# Altium schematic sheet Power.SchDoc: Power
size A4; Author: SchumyHao; DocumentNumber: 4; Revision: V01; SheetNumber: 4; SheetTotal: 7
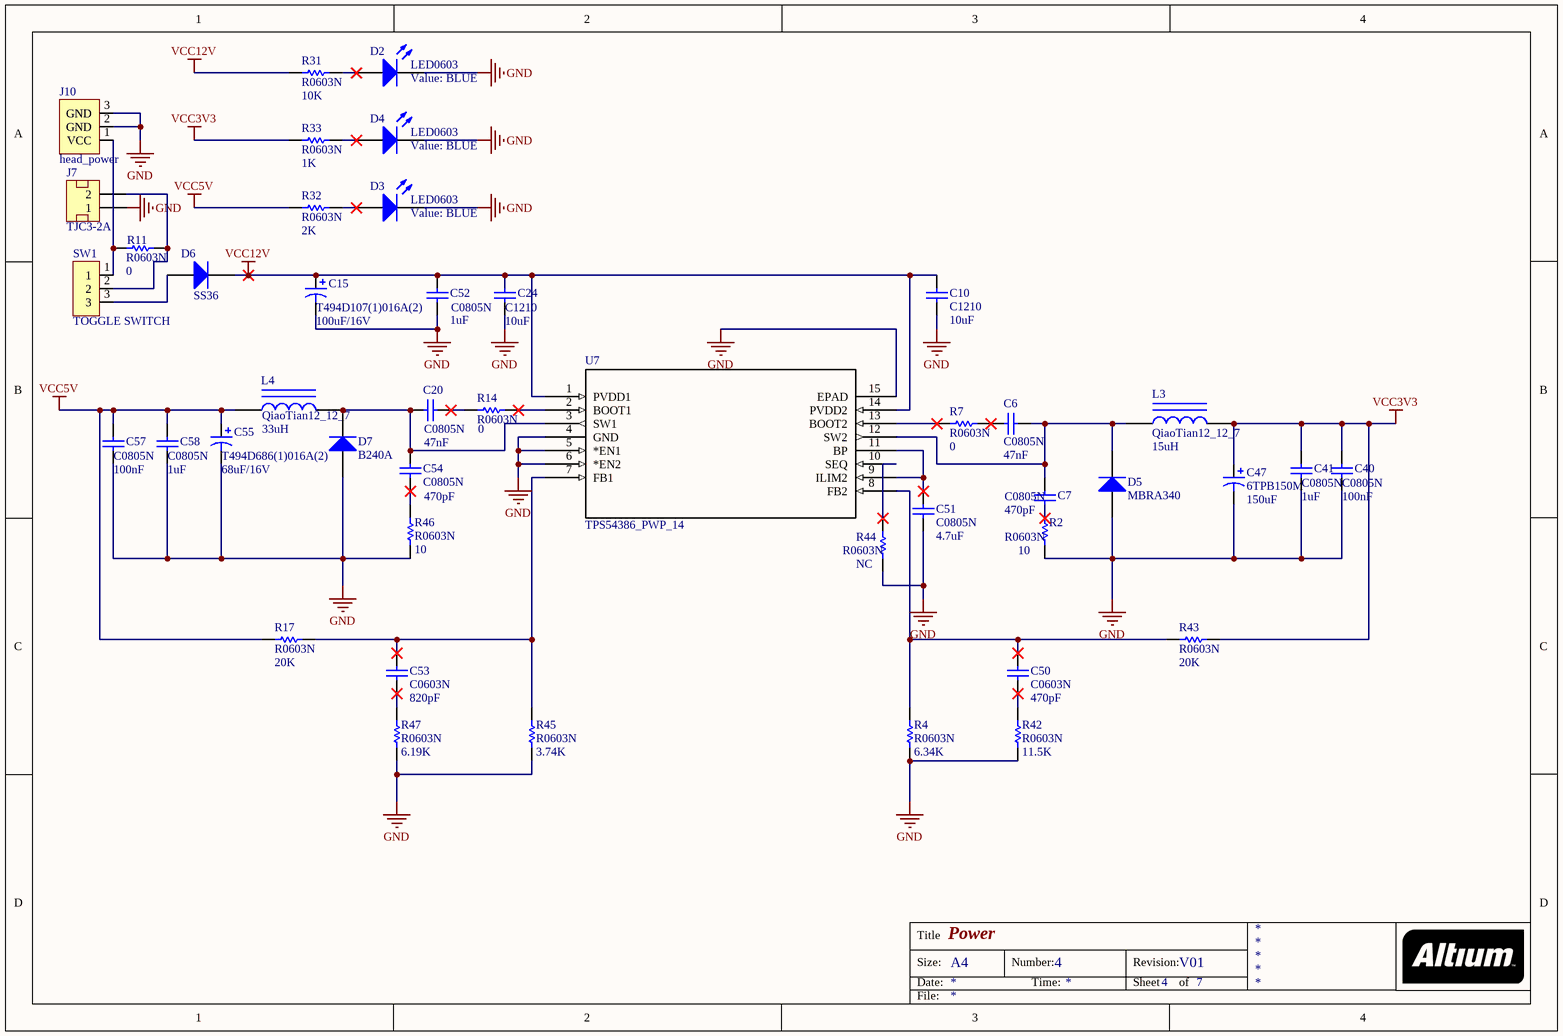
[diagram p0: Power.SchDoc]

## Parts
C6  C0805N  value 47nF  [C0805N]
C7  C0805N  value 470pF  [C0805N]
C10  C1210  value 10uF  [C1210]
C15  T494D107(1)016A(2)  value 100uF/16V  [16V220uF]
C20  C0805N  value 47nF  [C0805N]
C24  C1210  value 10uF  [C1210]
C40  C0805N  value 100nF  [C0805N]
C41  C0805N  value 1uF  [C0805N]
C47  6TPB150M  value 150uF  [16V220uF]
C50  C0603N  value 470pF  [C0603N]
C51  C0805N  value 4.7uF  [C0805N]
C52  C0805N  value 1uF  [C0805N]
C53  C0603N  value 820pF  [C0603N]
C54  C0805N  value 470pF  [C0805N]
C55  T494D686(1)016A(2)  value 68uF/16V  [16V220uF]
C57  C0805N  value 100nF  [C0805N]
C58  C0805N  value 1uF  [C0805N]
D2  LED0603  value BLUE  [LED0603]
D3  LED0603  value BLUE  [LED0603]
D4  LED0603  value BLUE  [LED0603]
D5  MBRA340  [403D_02]
D6  SS36  [DO-214AB]
D7  B240A  [403D_02]
J7  TJC3-2A  [TJC3-2A]
J10  head_power  [DC2.1]
L3  QiaoTian12_12_7  value 15uH  [CDRH127]
L4  QiaoTian12_12_7  value 33uH  [CDRH127]
R2  R0603N  value 10  [R0603N]
R4  R0603N  value 6.34K  [R0603N]
R7  R0603N  value 0  [R0603N]
R11  R0603N  value 0  [R0603N]
R14  R0603N  value 0  [R0603N]
R17  R0603N  value 20K  [R0603N]
R31  R0603N  value 10K  [R0603N]
R32  R0603N  value 2K  [R0603N]
R33  R0603N  value 1K  [R0603N]
R42  R0603N  value 11.5K  [R0603N]
R43  R0603N  value 20K  [R0603N]
R44  R0603N  value NC  [R0603N]
R45  R0603N  value 3.74K  [R0603N]
R46  R0603N  value 10  [R0603N]
R47  R0603N  value 6.19K  [R0603N]
SW1  TOGGLE SWITCH  [KEY-ONOFF]
U7  TPS54386_PWP_14  [PWP14_2P31X2P46-]

## Nets
GND: C10.1 C15.2 C24.2 C40.1 C41.1 C47.2 C51.1 C52.1 C55.2 C57.1 C58.1 D2.2(K) D3.2(K) D4.2(K) D5.1(A) D7.1(A) J7.1 J10.2(GND) J10.3(GND) R2.1 R4.1 R42.1 R44.2 R45.1 R46.1 R47.1 U7.4(GND) U7.5(*EN1) U7.6(*EN2) U7.15(EPAD)
VCC3V3: C40.2 C41.2 C47.1 L3.2 R33.2 R43.2
VCC5V: C55.1 C57.2 C58.2 L4.1 R17.1 R32.2
VCC12V: C10.2 C15.1 C24.1 C52.2 D6.2(K) R31.2 U7.1(PVDD1) U7.14(PVDD2)
NetC6_1: C6.1 R7.2
NetC6_2: C6.2 C7.2 D5.2(K) L3.1 U7.12(SW2)
NetC7_1: C7.1 R2.2
NetC20_1: C20.1 C54.2 D7.2(K) L4.2 U7.3(SW1)
NetC20_2: C20.2 R14.1
NetC50_1: C50.1 R42.2
NetC50_2: C50.2 R4.2 R43.1 U7.8(FB2)
NetC51_2: C51.2 U7.9(ILIM2) U7.11(BP)
NetC53_1: C53.1 R47.2
NetC53_2: C53.2 R17.2 R45.2 U7.7(FB1)
NetC54_1: C54.1 R46.2
NetD2_1: D2.1(A) R31.1
NetD3_1: D3.1(A) R32.1
NetD4_1: D4.1(A) R33.1
NetD6_1: D6.1(A) SW1.3
NetJ7_2: J7.2 R11.1 SW1.2
NetJ10_1: J10.1(VCC) R11.2 SW1.1
NetR7_1: R7.1 U7.13(BOOT2)
NetR14_2: R14.2 U7.2(BOOT1)
NetR44_1: R44.1 U7.10(SEQ)

## Notes on the sheet
- Title
- Size:
- Date:
- A4
- Number:
- Time:
- Revision:
- Sheet
- of
- File:

## Library data of the parts
C6 C7 C10 C20 C24 C40 C41 C50-C54 C57 C58 = Cap Semi: Capacitor (Semiconductor SIM Model)
C15 C47 C55 = Cap Pol3: Polarized Capacitor (Surface Mount)
D2-D4 = LED
D5-D7 = Diode: Default Diode
J7 = TJC3-2A: Set Position: 0.5; Published: 8-Jun-2000; LatestRevisionDate: 17-Jul-2002; LatestRevisionNote: Re-released for DXP Platform.; PackageReference: AXIAL-0.6; Publisher: Altium Limited
L3 L4 = Inductor Iron: Magnetic-Core Inductor
R2 R4 R7 R11 R14 R17 R31-R33 R42-R47 = Res Semi: Semiconductor Resistor
U7 = TPS54386_PWP_14: Imported; Vendor: Texas Instruments; PACKAGE_DESIGNATOR: PWP; PIN_COUNT: 14; FAMILY_NAME: STEP-DOWN REGULATOR; INDUSTRY_STD_PKG_TYPE: HTSSOP; Manufacturer_Part_Number: tps54386_pwp_14; GENERIC_PART_NUMBER: TPS54386; Datasheet URL: http://www.ti.com/lit/gpn/TPS54386; Manufacturer: Texas Instruments; RefDes: RefDes; Type: DEV; Value: Value